# EAGLE design mippe_32u4 (EAGLE 9.5.2)

## Sheet 1 of 2
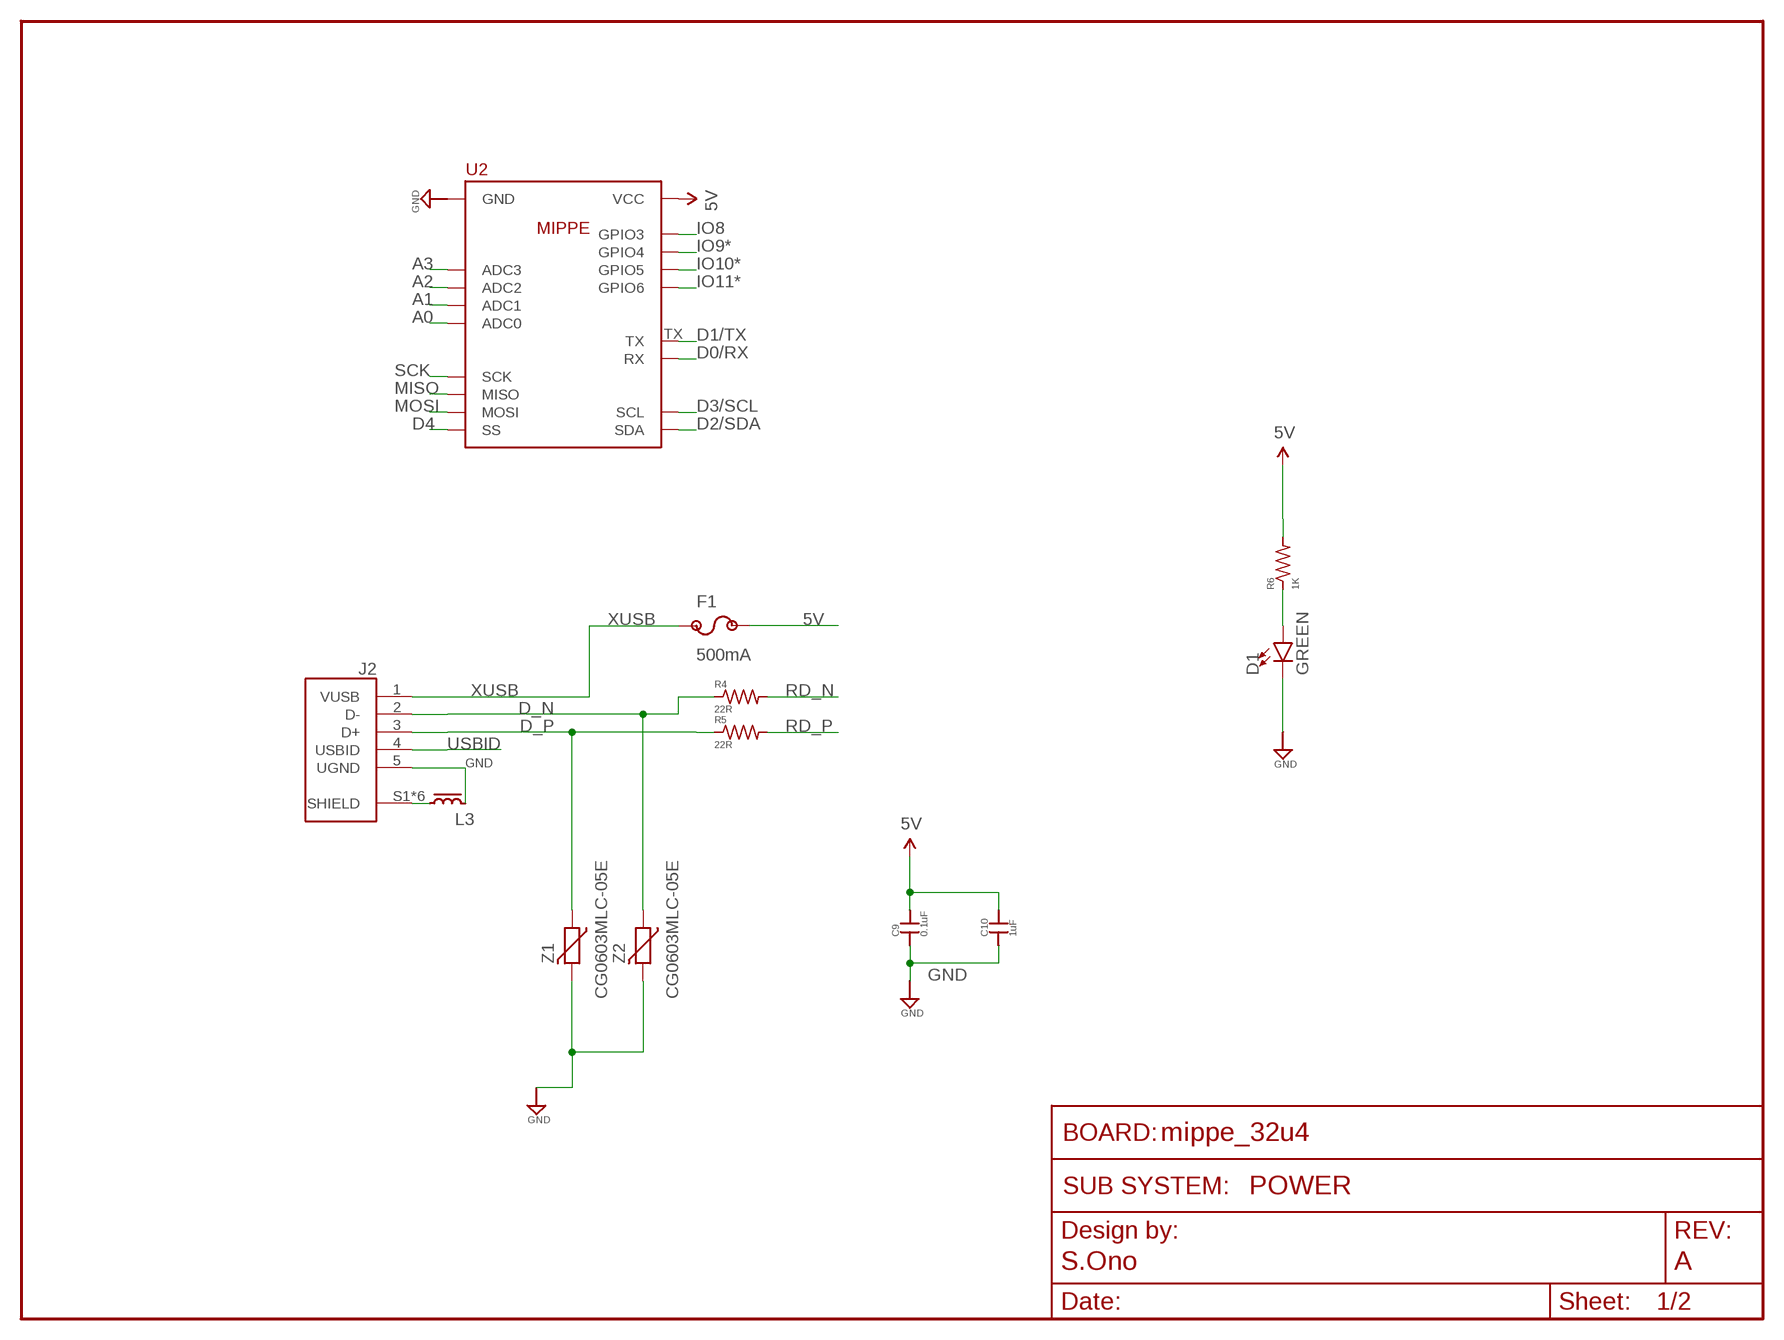
[diagram p0: schematic, sheet 1]
FRAME2 (FRAME_SCHEMATIC): AUTHOR: S.Ono; REV: A; SUBSYSTEM_NAME: POWER

### Parts
C9  0.1uF  CAP0603-CAP  [0603-CAP]
C10  1uF  CAP0603-CAP  [0603-CAP]
D1  GREEN  LED0603  [LED-0603]
F1  500mA  0ZCJ0050FF2G1206  [1206]
J2  USB  [FCI_10103594-0001LF]
L3  IND  [IND_2012]
R4  22R  R-US_0603  [0603-RES]
R5  22R  R-US_0603  [0603-RES]
R6  1K  R-US_0603  [0603-RES]
U2  MIPPE  [MIPPE]
Z1  CG0603MLC-05E  VARISTOR  [0603-RES]
Z2  CG0603MLC-05E  VARISTOR  [0603-RES]

### Nets
5V: C9.2 C10.2 F1.2 R6.2 U2.VCC U2.VCC@1(VCC) ; also sheet 2
A0: U2.ADC0 ; also sheet 2
A1: U2.ADC1 ; also sheet 2
A2: U2.ADC2 ; also sheet 2
A3: U2.ADC3 ; also sheet 2
D0/RX: U2.RX ; also sheet 2
D1/TX: U2.TX ; also sheet 2
D2/SDA: U2.SDA ; also sheet 2
D3/SCL: U2.SCL ; also sheet 2
D4: U2.SS ; also sheet 2
D_N: J2.2(D-) R4.1 Z2.1
D_P: J2.3(D+) R5.1 Z1.1
GND: C9.1 C10.1 D1.C J2.5(UGND) L3.2 U2.GND@0(GND) U2.GND@1(GND) Z1.2 Z2.2 ; also sheet 2
IO8: U2.GPIO3 ; also sheet 2
IO9*: U2.GPIO4 ; also sheet 2
IO10*: U2.GPIO5 ; also sheet 2
IO11*: U2.GPIO6 ; also sheet 2
MISO: U2.MISO ; also sheet 2
MOSI: U2.MOSI ; also sheet 2
N$3: D1.A R6.1
RD_N: R4.2 ; also sheet 2
RD_P: R5.2 ; also sheet 2
SCK: U2.SCK ; also sheet 2
SHIELD: J2.S1(SHIELD) J2.S2(SHIELD) J2.S3(SHIELD) J2.S4(SHIELD) J2.S5(SHIELD) J2.S6(SHIELD) L3.1
USBID: J2.4(USBID)
XUSB: F1.1 J2.1(VUSB)

## Sheet 2 of 2
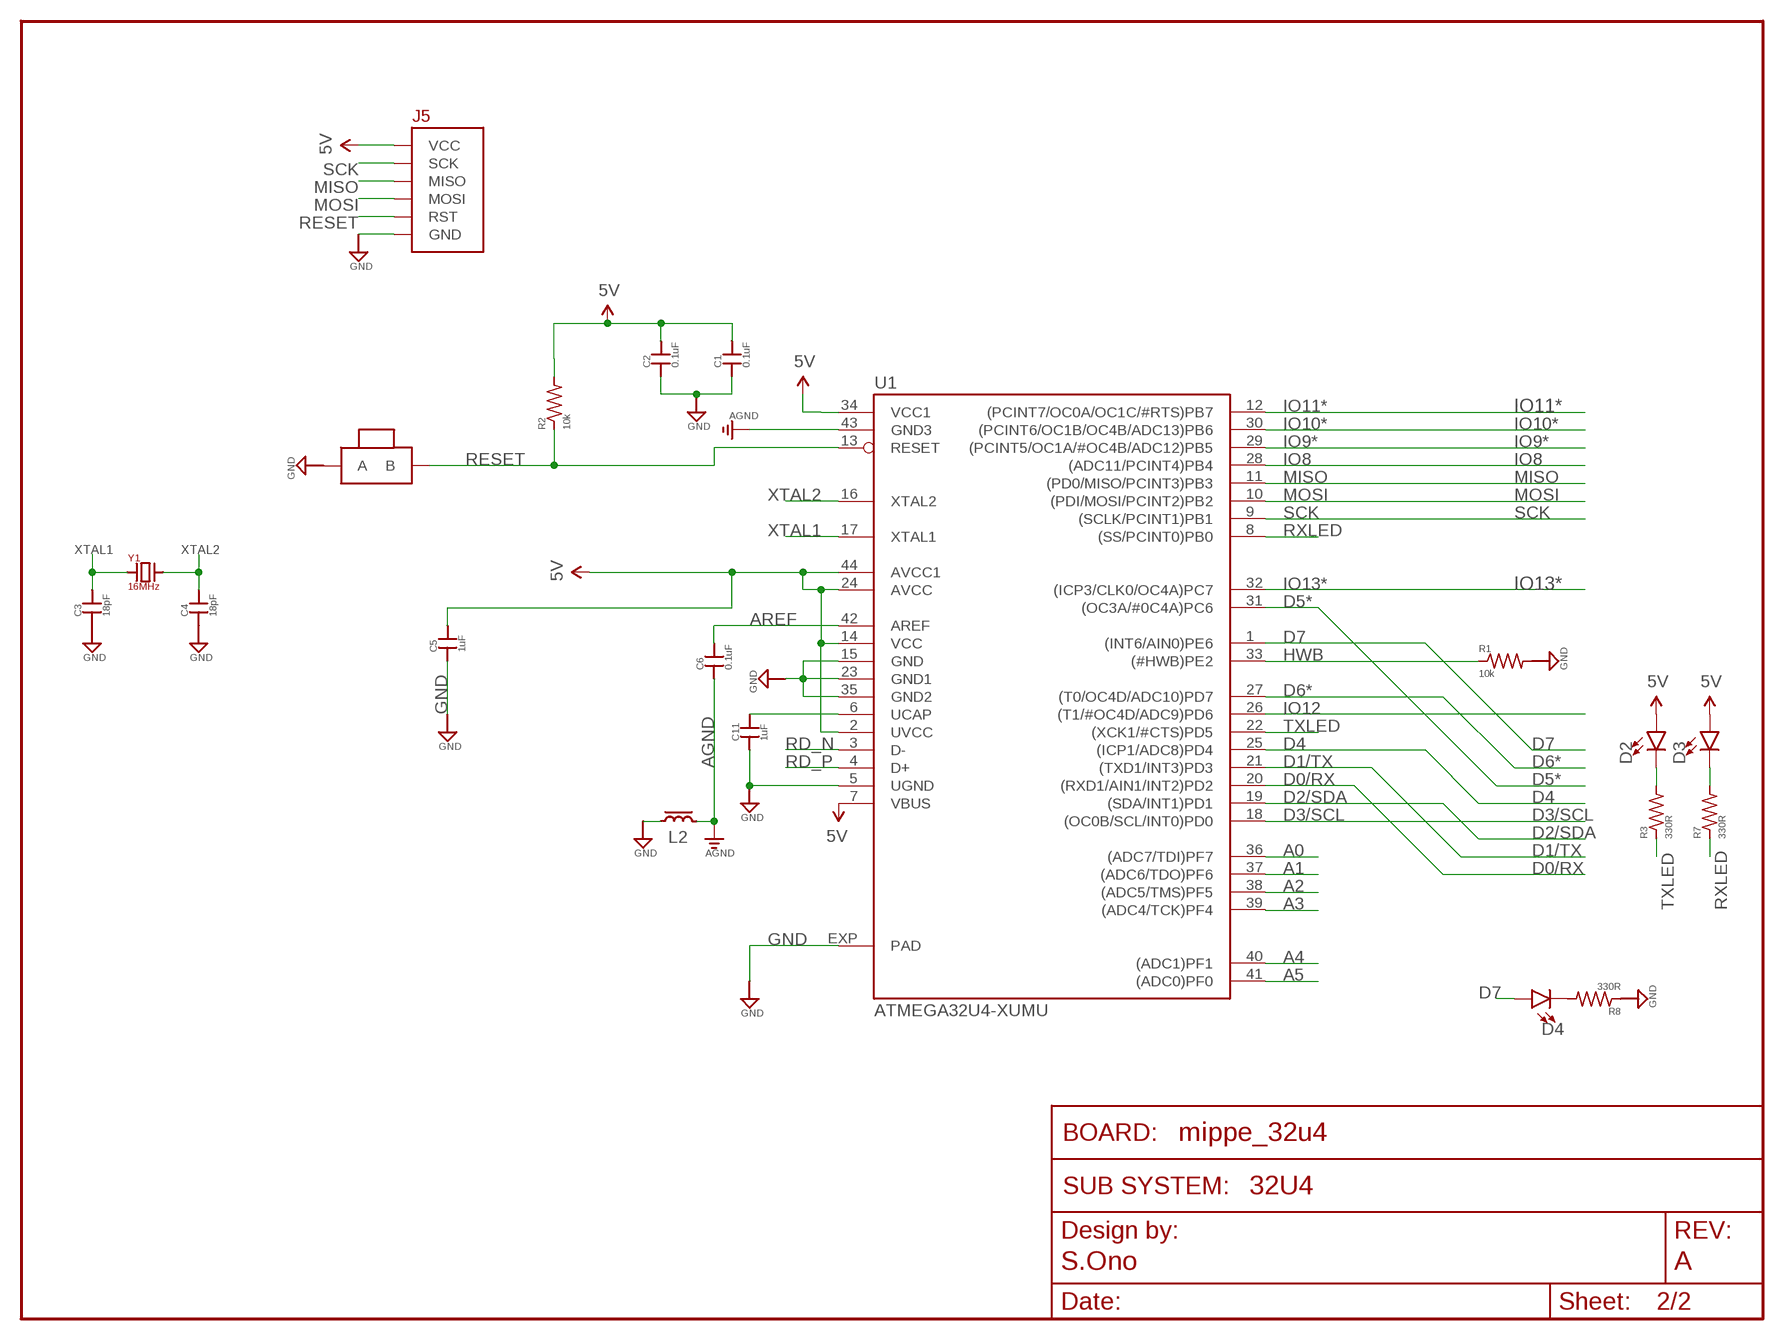
[diagram p1: schematic, sheet 2]
FRAME1 (FRAME_SCHEMATIC): AUTHOR: S.Ono; REV: A; SUBSYSTEM_NAME: 32U4

### Parts
C1  0.1uF  CAP0603-CAP  [0603-CAP]
C2  0.1uF  CAP0603-CAP  [0603-CAP]
C3  18pF  CAP0603-CAP  [0603-CAP]
C4  18pF  CAP0603-CAP  [0603-CAP]
C5  1uF  CAP0603-CAP  [0603-CAP]
C6  0.1uF  CAP0603-CAP  [0603-CAP]
C11  1uF  CAP0603-CAP  [0603-CAP]
D2  LED0603  [LED-0603]
D3  LED0603  [LED-0603]
D4  LED0603  [LED-0603]
J5  BURNIN  [BURNIN]
L2  IND  [IND_2012]
R1  10k  R-US_0603  [0603-RES]
R2  10k  R-US_0603  [0603-RES]
R3  330R  R-US_0603  [0603-RES]
R7  330R  R-US_0603  [0603-RES]
R8  330R  R-US_0603  [0603-RES]
SW1  BTN-PTS810  [BTN_PTS810]
U1  ATMEGA32U4-XUMU  [QFN44ML7X7]
Y1  16MHz  CRYSTAL_SMOL  [XTAL500X320X130N]

### Nets
5V: C1.2 C2.2 C5.2 D2.A D3.A J5.3.3V(VCC) R2.2 U1.2(UVCC) U1.7(VBUS) U1.14(VCC) U1.24(AVCC) U1.34(VCC1) U1.44(AVCC1) ; also sheet 1
A0: U1.36((ADC7/TDI)PF7) ; also sheet 1
A1: U1.37((ADC6/TDO)PF6) ; also sheet 1
A2: U1.38((ADC5/TMS)PF5) ; also sheet 1
A3: U1.39((ADC4/TCK)PF4) ; also sheet 1
A4: U1.40((ADC1)PF1)
A5: U1.41((ADC0)PF0)
AGND: C6.1 L2.2 U1.43(GND3)
AREF: C6.2 U1.42(AREF)
D0/RX: U1.20((RXD1/AIN1/INT2)PD2) ; also sheet 1
D1/TX: U1.21((TXD1/INT3)PD3) ; also sheet 1
D2/SDA: U1.19((SDA/INT1)PD1) ; also sheet 1
D3/SCL: U1.18((OC0B/SCL/INT0)PD0) ; also sheet 1
D4: U1.25((ICP1/ADC8)PD4) ; also sheet 1
D5*: U1.31((OC3A/#0C4A)PC6)
D6*: U1.27((T0/OC4D/ADC10)PD7)
D7: D4.A U1.1((INT6/AIN0)PE6)
GND: C1.1 C2.1 C3.1 C4.1 C5.1 C11.1 J5.GND L2.1 R1.2 R8.1 SW1.1(A) SW1.2(A) U1.5(UGND) U1.15(GND) U1.23(GND1) U1.35(GND2) U1.EXP(PAD) ; also sheet 1
HWB: R1.1 U1.33((#HWB)PE2)
IO8: U1.28((ADC11/PCINT4)PB4) ; also sheet 1
IO9*: U1.29((PCINT5/OC1A/#OC4B/ADC12)PB5) ; also sheet 1
IO10*: U1.30((PCINT6/OC1B/OC4B/ADC13)PB6) ; also sheet 1
IO11*: U1.12((PCINT7/OC0A/OC1C/#RTS)PB7) ; also sheet 1
IO12: U1.26((T1/#OC4D/ADC9)PD6)
IO13*: U1.32((ICP3/CLK0/OC4A)PC7)
MISO: J5.MISO U1.11((PD0/MISO/PCINT3)PB3) ; also sheet 1
MOSI: J5.MOSI U1.10((PDI/MOSI/PCINT2)PB2) ; also sheet 1
N$1: D2.C R3.2
N$2: D3.C R7.2
N$4: D4.C R8.2
RD_N: U1.3(D-) ; also sheet 1
RD_P: U1.4(D+) ; also sheet 1
RESET: J5.RST R2.1 SW1.3(B) SW1.4(B) U1.13(RESET)
RXLED: R7.1 U1.8((SS/PCINT0)PB0)
SCK: J5.SCK U1.9((SCLK/PCINT1)PB1) ; also sheet 1
TXLED: R3.1 U1.22((XCK1/#CTS)PD5)
UCAP: C11.2 U1.6(UCAP)
XTAL1: C3.2 U1.17(XTAL1) Y1.1(A)
XTAL2: C4.2 U1.16(XTAL2) Y1.2(B)

## Library data of the parts
C1-C6 C9-C11 = scono:CAP: Capacitor Standard 0603 ceramic capacitor, and 0.1" leaded capacitor.; PIE-INT-REF-NUM: CAPACITOR-GENERIC
D1-D4 = scono:LED: https://www.digikey.com/products/en/optoelectronics/led-indication-discrete/105?k=&pkeyword=&pv7=2&pv1989=0&pv16=5&FV=ffe00069&quantity=0&ColumnSort=0&page=1&pageSize=25
F1 = scono:0ZCJ0050FF2G: https://www.digikey.com/product-detail/en/bel-fuse-inc/0ZCJ0050FF2G/507-1802-1-ND/4156236
J2 = scono:USB: Micro Usb, 2.0 Type b, Receptacle, Smt; DESCRIPTION: Micro Usb, 2.0 Type b, Receptacle, Smt; DIGI-KEY_PART_NUMBER: 609-4050-1-ND; DIGI-KEY_PURCHASE_URL: https://www.digikey.com/product-detail/en/amphenol-icc-fci/10103594-0001LF/609-4050-1-ND/2350357?utm_source=snapeda&utm_medium=aggregator&utm_campaign=symbol; MF: Amphenol ICC; MP: 10103594-0001LF; PACKAGE: None
J5 = scono:BURNIN
L2 L3 = scono:IND; MANUFACTURER_PART_NUMBER: MLZ2012M1R0HT000; VENDOR: TDK
R1-R8 = scono:R-US_: RESISTOR, American symbol
SW1 = scono:BTN-PTS810: https://www.digikey.com/product-detail/en/c-k/PTS810-SJM-250-SMTR-LFS/CKN10502CT-ND/4176673
U1 = scono:ATMEGA32U4-XU
U2 = scono:MIPPE
Y1 = scono:CRYSTAL
Z1 Z2 = scono:VARISTOR: VARISTOR

## Net classes
0 default: width 0.089 mm, drill 0.2 mm, clearance 0.14 mm
2 gnd: width 0.089 mm, drill 0.2 mm, clearance 0.152 mm to class 1, clearance 0.14 mm

## Board
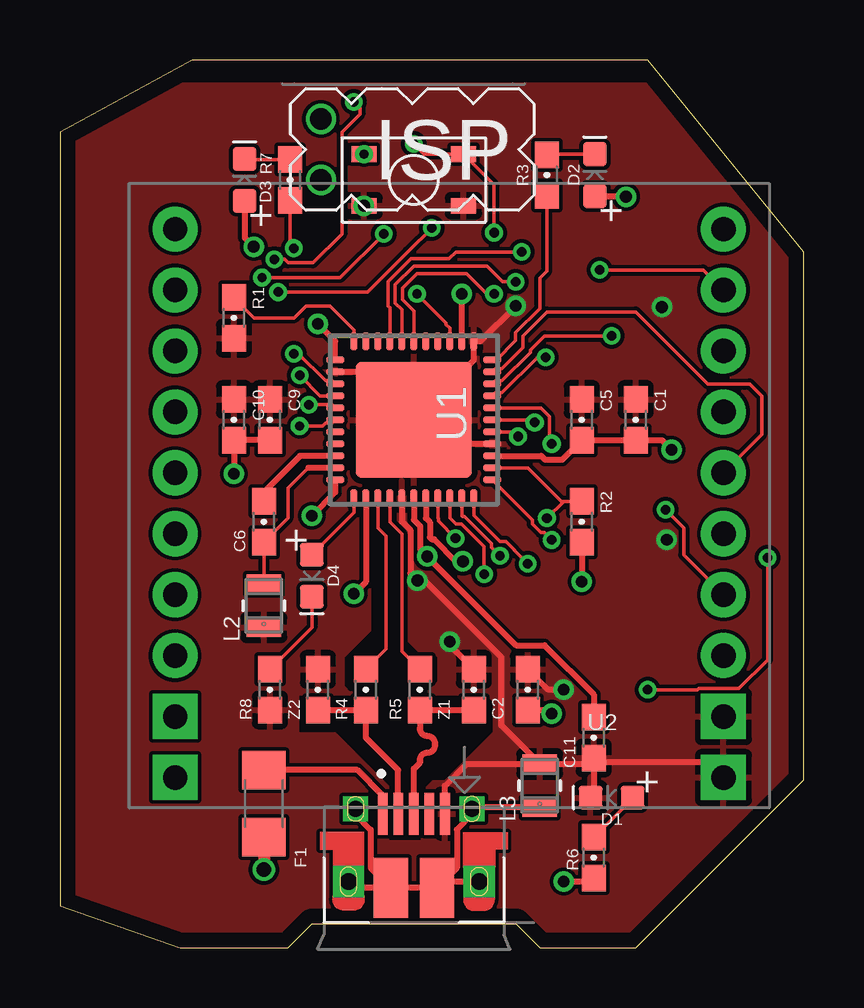
[diagram p2: board, top side]
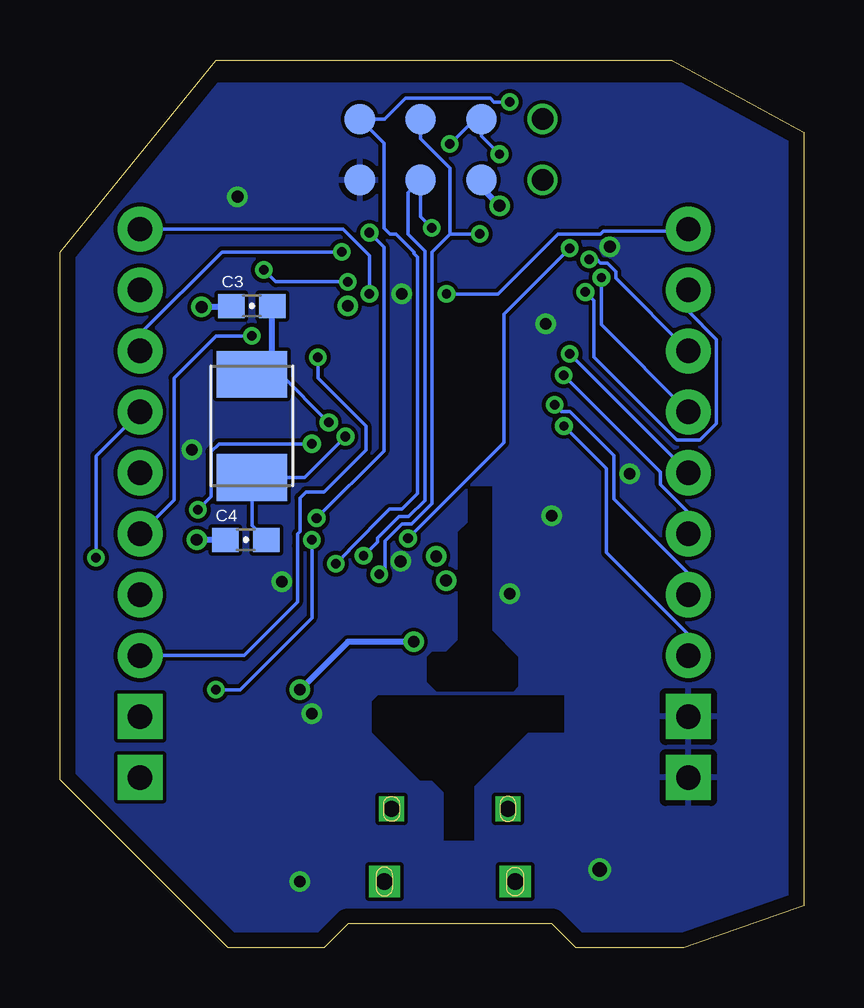
[diagram p3: board, bottom side, seen from below]

Size 31 x 37 mm. Coordinates in mm from the lower left corner, seen from the top.
Outline: 10.5,1 19,1 20,0 24,0 31,7 31,29 24.5,37 5.5,37 0,34 0,1.75 5,0 9.5,0 10.5,1
Copper layers (1*16): Top 2mil / dielectric 9mil / Bottom 2mil
Design rules "scono": minimum track width 6mil, minimum drill 15mil, track to track 6mil, track to pad 6mil, pad to pad 6mil, via to via 6mil, smd to smd 6mil, copper to edge 25mil, drill to drill 7mil, minimum pad ring 7mil, minimum via ring 7mil, stop-mask expansion 3mil, vias tented up to drill 0mil, thermal gap 10mil
tRestrict: 26 lines
bRestrict: 26 lines

### Footprints (pad centres in the part's own frame; a part is rotated, then mirrored left to right if it is on the bottom)
0603-CAP = smd 1.1 x 1: 1 -0.85,0; 2 0.85,0
LED-0603 = smd 1 x 1: A -0.877,0; C 0.877,0
1206 = smd 1.6 x 1.8: 1 -1.4,0; 2 1.4,0
FCI_10103594-0001LF = smd 0.4 x 1.75: 1 -1.3,2.825; 2 -0.65,2.825; 3 0,2.825; 4 0.65,2.825; 5 1.3,2.825 | smd 1.425 x 2.5: S1 -0.963,-0.25; S2 0.963,-0.25 | drill 0.65 pad 1.05 square: S3 -2.425,3.03; S4 2.425,3.03 | drill 0.7 pad 1.3 square: S5 -2.725,0; S6 2.725,0
BURNIN = smd 1.27 x 1.27 bottom: 3.3V 0,0; GND -5.08,0; MISO 0,2.54; MOSI -2.54,0; RST -5.08,2.54; SCK -2.54,2.54 | drill 0.9: P$7 -7.62,2.54; P$8 -7.62,0
IND_2012 = smd 0.803 x 1.45: 1 -0.902,0; 2 0.902,0
0603-RES = smd 1.1 x 1: 1 -0.85,0; 2 0.85,0
BTN_PTS810 = smd 1.05 x 0.65: 1 -2.075,1.075; 2 2.075,1.075; 3 -2.075,-1.075; 4 2.075,-1.075
QFN44ML7X7 = smd 0.75 x 0.275: 1 -3.275,2.5; 2 -3.275,2; 3 -3.275,1.5; 4 -3.275,1; 5 -3.275,0.5; 6 -3.275,0; 7 -3.275,-0.5; 8 -3.275,-1; 9 -3.275,-1.5; 10 -3.275,-2; 11 -3.275,-2.5; 23 3.275,-2.5; 24 3.275,-2; 25 3.275,-1.5; 26 3.275,-1; 27 3.275,-0.5; 28 3.275,0; 29 3.275,0.5; 30 3.275,1; 31 3.275,1.5; 32 3.275,2; 33 3.275,2.5 | smd 0.275 x 0.75: 12 -2.5,-3.275; 13 -2,-3.275; 14 -1.5,-3.275; 15 -1,-3.275; 16 -0.5,-3.275; 17 0,-3.275; 18 0.5,-3.275; 19 1,-3.275; 20 1.5,-3.275; 21 2,-3.275; 22 2.5,-3.275; 34 2.5,3.275; 35 2,3.275; 36 1.5,3.275; 37 1,3.275; 38 0.5,3.275; 39 0,3.275; 40 -0.5,3.275; 41 -1,3.275; 42 -1.5,3.275; 43 -2,3.275; 44 -2.5,3.275 | smd 4.826 x 4.826: EXP 0,0
MIPPE = drill 1.016 pad 1.88: ADC0 12.7,-2.54; ADC1 12.7,0; ADC2 12.7,2.54; ADC3 12.7,5.08; GPIO3 -10.16,-12.7; GPIO4 -10.16,-10.16; GPIO5 -10.16,-7.62; GPIO6 -10.16,-5.08; MISO 12.7,-7.62; MOSI 12.7,-10.16; RX -10.16,0; SCK 12.7,-5.08; SCL -10.16,2.54; SDA -10.16,5.08; SS 12.7,-12.7; TX -10.16,-2.54 | drill 1.016 pad 1.88 square: GND@0 -10.16,7.62; GND@1 -10.16,10.16; VCC 12.7,10.16; VCC@1 12.7,7.62
XTAL500X320X130N = smd 1.95 x 2.95: 1 -2.15,0; 2 2.15,0

### Placement (x,y rotation side)
C1  24,22 270 top
C2  19.5,10.75 270 top
C3  23,26.75 0 bottom
C4  23.25,17 0 bottom
C5  21.75,22 270 top
C6  8.5,17.75 90 top
C9  8.75,22 270 top
C10  7.25,22 270 top
C11  22.25,8.75 90 top
D1  23,6.25 180 top
D2  22.3,32.2 90 top
D3  7.7,32 90 top
D4  10.5,15.5 270 top
F1  8.5,6 270 top
J2  14.75,2.75 0 top
J5  18.5,32 0 top
L2  8.5,14.25 90 top
L3  20,6.75 90 top
R1  7.25,26.25 270 top
R2  21.75,17.75 270 top
R3  20.3,32.2 90 top
R4  12.75,10.75 90 top
R5  15,10.75 90 top
R6  22.25,3.75 270 top
R7  9.6,32 90 top
R8  8.75,10.75 90 top
SW1  14.75,32 180 top
U1  14.75,22 90 top
U2  17.5,17.25 180 top
Y1  23,21.75 270 bottom
Z1  17.25,10.75 90 top
Z2  10.75,10.75 90 top

### Tracks (layer width: path | path; a pad name or v marks a point on that pad's centre or on a via)
5V  (via drill 0.5, 0.6)
  Top 0.254: C9.2 C10.2 v7.25,19.75 | C2.2 20.35,9.9 v20.5,9.75 | R6.2 22.1,2.75 v21,2.75 | R2.2 v21.75,15.25 | U1.2 12.75,15.25 v12.25,14.75 | U1.44 11.47,18.98 v10.5,18 | U1.34 11.47,25.27 v10.75,26 | U1.7 15.25,17.9 15.42,17.73 15.42,17.1 15.51,17.01 15.61,17.01 16.52,16.1 v16.8,16.1 | D2.A 23.58,31.32 v23.6,31.3 | v25.5,20.75 25.1,21.15 C1.2 C5.2 20.94,20.34 20.23,20.34 20.07,20.5 U1.14 | D3.A 7.7,29.59 v8.08,29.21 | U1.24 v16.75,27.25
  Top 0.5: F1.2 v8.5,3.25
  pour Bottom: -1.75,36 -1.75,0 32,0 32,36
A0  (via drill 0.39)
  Top 0.152: U1.36 11.34,23.63 11.07,23.63 9.95,24.75 v9.75,24.75
  Bottom 0.152: v9.75,24.75 U2.ADC0
A1  (via drill 0.39)
  Top 0.152: U1.37 10.85,23 v10,23.85
  Bottom 0.152: v10,23.85 5.97,19.82 5.97,19.31 4.8,18.14 U2.ADC1
A2  (via drill 0.39)
  Top 0.152: U1.38 11.35,22.63 v10.38,22.63
  Bottom 0.152: v10.38,22.63 10.09,22.34 9.74,22.34 7.91,20.51 7.91,18.7 4.8,15.6 U2.ADC2
A3  (via drill 0.39)
  Top 0.152: U1.39 11.34,21.87 11.07,21.87 10.94,21.74 v9.99,21.74
  Bottom 0.152: v9.99,21.74 8.21,19.96 8.21,16.47 4.8,13.06 U2.ADC3
AGND
  Top 0.152: 10.35,20 9.5,19.15 9.5,17.9 C6.1 L2.2
  Top 0.254: U1.43 10.35,20
AREF
  Top 0.254: U1.42 10,20.5 8.5,19 C6.2
D0/RX  (via drill 0.39)
  Top 0.152: U1.20 18.16,23.63 18.43,23.63 19.61,24.81 19.61,24.91 20.2,25.5 v23,25.5
  Bottom 0.152: v23,25.5 24.5,25.5 26.25,23.75 26.25,18.66 U2.RX
D1/TX
  Top 0.152: U1.21 18.16,24.13 18.43,24.13 19.3,25 19.3,25.5 20.3,26.5 24,26.5 27,23.5 28.75,23.5 29.25,23 29.25,21.38 U2.TX
D2/SDA  (via drill 0.39)
  Top 0.152: U1.19 18.16,23.13 18.43,23.13 19.9,24.6 v20.25,24.6
  Bottom 0.152: v20.25,24.6 20.25,23.75 18.25,21.75 18.25,20.75 20,19 20.75,19 21,18.75 21,17.35 21.1,17.25 21.1,16.75 21.09,16.74 21.09,14.41 23.33,12.17 U2.SDA
D3/SCL  (via drill 0.39, 0.4)
  Top 0.152: v20.5,21 20.4,21.1 20.4,22.14 20.04,22.5 U1.18 | v25.25,18.25 26,17.5 26,16.37 U2.SCL
  Bottom 0.152: v25.25,18.25 24.7,18.8 24.7,20.67 24.37,21 v20.5,21
D4  (via drill 0.39)
  Top 0.152: U1.25 16.25,25.82 16.09,25.98 16.09,26.04 v14.88,27.25
  Bottom 0.152: U2.SS 4.88,29.87 8.35,29.87 8.47,29.75 10.25,29.75 12.75,27.25 v14.88,27.25
D7
  Top 0.152: D4.A 12.25,18.13 U1.1
D_N
  Top 0.254: Z2.1 R4.1 12.75,8.75 14.1,7.4 J2.2
D_P
  Top 0.254: Z1.1 R5.1 15,9.14 arc90 15.32,8.82 arc-90 15.63,8.5 15.63,8.44 arc-90 15.32,8.12 arc90 15,7.8 15,7.7 14.75,7.45 J2.3
GND  (via drill 0.5)
  Top 0.254: U1.15 15.75,21 U1.EXP | U1.EXP 12.75,24 U1.35 | U1.EXP 17.25,24.5 U1.23 17.52,25.27 v19,26.75 | Z1.2 16.25,12.6 v16.25,12.75 | v21,10.75 20.35,10.75 C2.1 | U1.5 14.25,17.75 14.61,17.4 14.61,15.6 v14.91,15.3 15.2,15.3 18.4,12.1 18.4,9.25 L3.2 | J2.5 16.05,6.75 16.95,7.65 L3.2 | L3.2 22,7.65 C11.1 | C11.1 22.25,6.38 D1.C | C11.1 22.4,7.75 27,7.75 U2.GND@1
  Bottom 0.254: C4.1 v25.3,17 | C3.1 23.9,26.7 v25.1,26.7 | v16.25,12.75 19,12.75 v21,10.75 | J5.GND 13.42,31.67 SW1.2
  other vias: 12.68,30.93
  pour Top: -1.75,0 32,0 32,36 -1.75,36
HWB
  Top 0.152: U1.33 12.25,25.75 11.25,26.75 10.25,26.75 9.75,26.25 8.1,26.25 R1.1
IO8  (via drill 0.39)
  Top 0.152: v18.1,27.25 17.8,27.25 16.95,28.1 14.88,28.1 14.28,27.5 14.28,27 14.75,26.53 U1.28
  Bottom 0.152: v18.1,27.25 18.1,28.85 19.2,29.95 U2.GPIO3
IO9*  (via drill 0.39)
  Top 0.152: v19,27.75 18.45,27.75 17.8,28.41 16.5,28.41 16.32,28.41 14.76,28.41 13.98,27.62 13.98,26.88 14.25,26.6 U1.29 | v22.5,28.25 26.82,28.25 U2.GPIO4
  Bottom 0.152: v19,27.75 22,27.75 v22.5,28.25
IO10*  (via drill 0.39)
  Top 0.152: v19.25,29 16.5,29 16.21,28.71 14.63,28.71 13.67,27.75 13.67,26.75 13.75,26.67 U1.30
  Bottom 0.152: v19.25,29 24.25,29 27.66,25.59 U2.GPIO5
IO11*  (via drill 0.39)
  Top 0.152: U1.12 19.69,17.83 19.69,17.65 20.05,17.29 20.2,17.29 v20.5,17 | v24.5,10.75 26.58,10.75 26.63,10.8 28.3,10.8 29.5,12 v29.5,16.25
  Bottom 0.152: U2.GPIO6 29.37,20.62 29.5,20.49 v29.5,16.25 | v20.5,17 20.5,13.75 23.5,10.75 v24.5,10.75
MISO  (via drill 0.39)
  Top 0.152: U1.11 17.25,18.02 18.34,16.93 18.59,16.93 18.94,16.58 18.94,16.56 v19.5,16 | v8.94,28.69 9.36,28.69 9.5,28.55 10.55,28.55 11.75,29.75 11.75,34 12.5,34.75 12.5,35 v12.25,35.25
  Bottom 0.152: v19.5,16 18.94,16.56 18.94,16.58 17.25,18.27 16.75,18.27 16.09,18.93 16.09,28.77 16.25,28.93 16.25,29 17,29.75 17.25,29.75 17.49,29.99 17.49,30.05 17.5,30.06 17.5,33.54 J5.MISO 17.46,34.54 16.6,35.4 13.06,35.4 12.91,35.25 v12.25,35.25 | v8.94,28.69 8.62,28.69 8.46,28.53 8.18,28.53 7.83,28.18 7.83,27.9 U2.MISO
MOSI  (via drill 0.39)
  Top 0.152: U1.10 16.75,18 16.78,17.97 16.87,17.97 17.99,16.84 17.99,16.68 v18.34,16.33 | v15.5,30 14.52,29.02 14.51,29.02 12.82,27.33 v9.1,27.33
  Bottom 0.152: v18.34,16.33 17.76,16.91 17.76,17.08 16.87,17.97 16.46,17.97 15.79,18.64 15.79,29.04 16.5,29.75 16.5,31.46 J5.MOSI 15.96,30.46 v15.5,30 | v9.1,27.33 8.73,26.96 8.73,24.61 5.28,21.16 4.32,21.16 3.63,21.85 3.63,25.35 4.8,26.52 U2.MOSI
N$1
  Top 0.152: R3.2 20.33,33.08 D2.C
N$2
  Top 0.152: R7.2 7.73,32.85 D3.C
N$3
  Top 0.152: R6.1 23.88,6.23 D1.A
N$4
  Top 0.152: D4.C 10.5,13.35 R8.2
RD_N
  Top 0.152: U1.3 13.25,17.5 13.6,17.15 13.6,12.45 R4.2
RD_P
  Top 0.152: R5.2 14.25,12.35 14.25,17.25 13.75,17.75 U1.4
RESET  (via drill 0.39, 0.4)
  Top 0.152: U1.13 19.5,20 20.9,18.6 R2.1 21,18.6 v20.3,17.9 | v18.1,29.8 18.1,31.8 SW1.3 15.18,33.08 v14.75,33.5
  Bottom 0.152: v20.3,17.9 17.5,20.7 17.5,29.2 v18.1,29.8 | SW1.4 13.42,33.82 13.42,34.25 | 13.42,34.25 J5.RST | v14.75,33.5 14,34.25 13.42,34.25
  other vias: 12.68,33.08
RXLED  (via drill 0.39, 0.4)
  Top 0.152: U1.8 15.75,17.91 15.77,17.88 15.77,17.77 v16.49,17.06 | v9.75,29.15 9.6,29.3 R7.1
  Bottom 0.152: v16.49,17.06 12.5,21.05 12.5,26.4 v9.75,29.15
SCK  (via drill 0.39)
  Top 0.152: U1.9 16.25,17.91 16.5,17.66 16.74,17.66 17.69,16.72 v17.69,15.56 | v13.5,29.75 11.68,27.93 v8.43,27.93
  Bottom 0.152: v17.69,15.56 17.46,15.79 17.46,16.95 16.74,17.66 16.34,17.66 15.48,18.52 15.48,29 14.75,29.73 | J5.SCK 15.96,33.71 14.75,32.5 14.75,29.73 | 14.75,29.73 13.52,29.73 v13.5,29.75 | v8.43,27.93 8.43,25.96 U2.SCK
SHIELD
  Top 0.254: J2.S6 15.96,2.75 15.76,2.54 | 15.76,2.54 J2.S2 J2.S1 | J2.S1 12.28,2.5 J2.S5 | 15.76,2.54 16.55,3.33 16.55,4.92 17.18,5.54 J2.S4 17.24,5.85 L3.1 | J2.S1 12.95,3.33 12.95,4.92 12.32,5.54 J2.S3
TXLED
  Top 0.152: R3.1 20.3,28.2 20,27.9 20,26.63 19,25.63 19,25.3 18.2,24.5 U1.22
UCAP  (via drill 0.5)
  Top 0.254: U1.6 14.75,17.83 15.01,17.57 15.01,16.61 v15.31,16.31 19.02,12.6 20.2,12.6 22.25,10.55 C11.2
XTAL1  (via drill 0.4)
  Top 0.152: v19.79,21.89 19.68,22 U1.17
  Bottom 0.152: v19.79,21.89 21.85,23.95 22.95,23.95
  Bottom 0.254: Y1.1 22.95,23.95 22.15,24.75 C3.2
XTAL2  (via drill 0.4)
  Top 0.152: U1.16 18.9,21.5 v19.1,21.3
  Bottom 0.152: C4.2 23,17.6 Y1.2 20.8,19.6 v19.1,21.3
XUSB
  Top 0.254: J2.1 13.45,6.35 12.4,7.4 F1.1

### Text on the board
tStop: Arias Research Group
bCream: Design by Seiya Fa'19